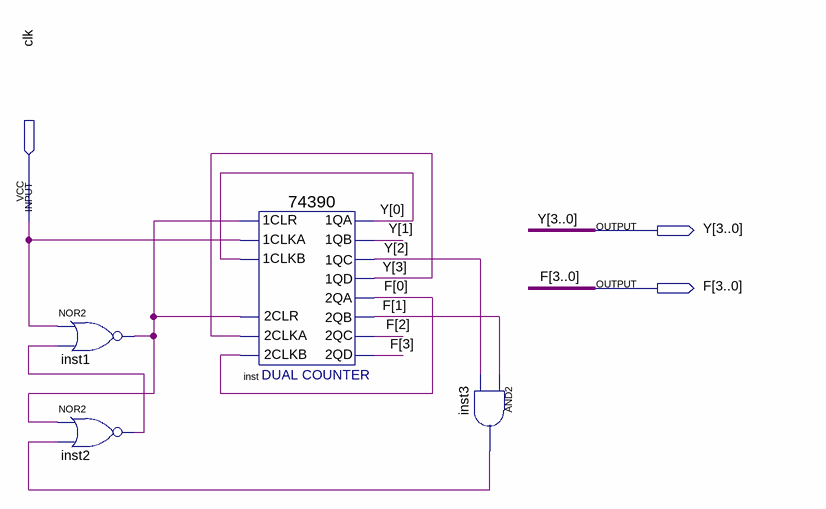
[diagram p0: schematic sheet]
// Quartus schematic lab2.bdf as structural Verilog: 4 symbols, 3 pins
module lab2 (
  input  clk,
  output [3:0] Y,
  output [3:0] F
);

  wire inst1_out, inst2_out, inst3_out;

  nor inst1 (inst1_out, clk, inst2_out);
  nor inst2 (inst2_out, inst1_out, inst3_out);
  \74390  inst (
    .\2CLKA (Y[3]), .\2CLR (inst1_out), .\2CLKB (F[0]), .\1CLR (inst1_out), .\1CLKA (clk), .\1CLKB (Y[0]),
    .\1QA (Y[0]), .\1QB (Y[1]), .\1QC (Y[2]), .\1QD (Y[3]), .\2QA (F[0]), .\2QB (F[1]), .\2QC (F[2]),
    .\2QD (F[3]));
  and inst3 (inst3_out, F[1], Y[2]);
endmodule
